# EAGLE design MRDT0003C1 (EAGLE 6.2)
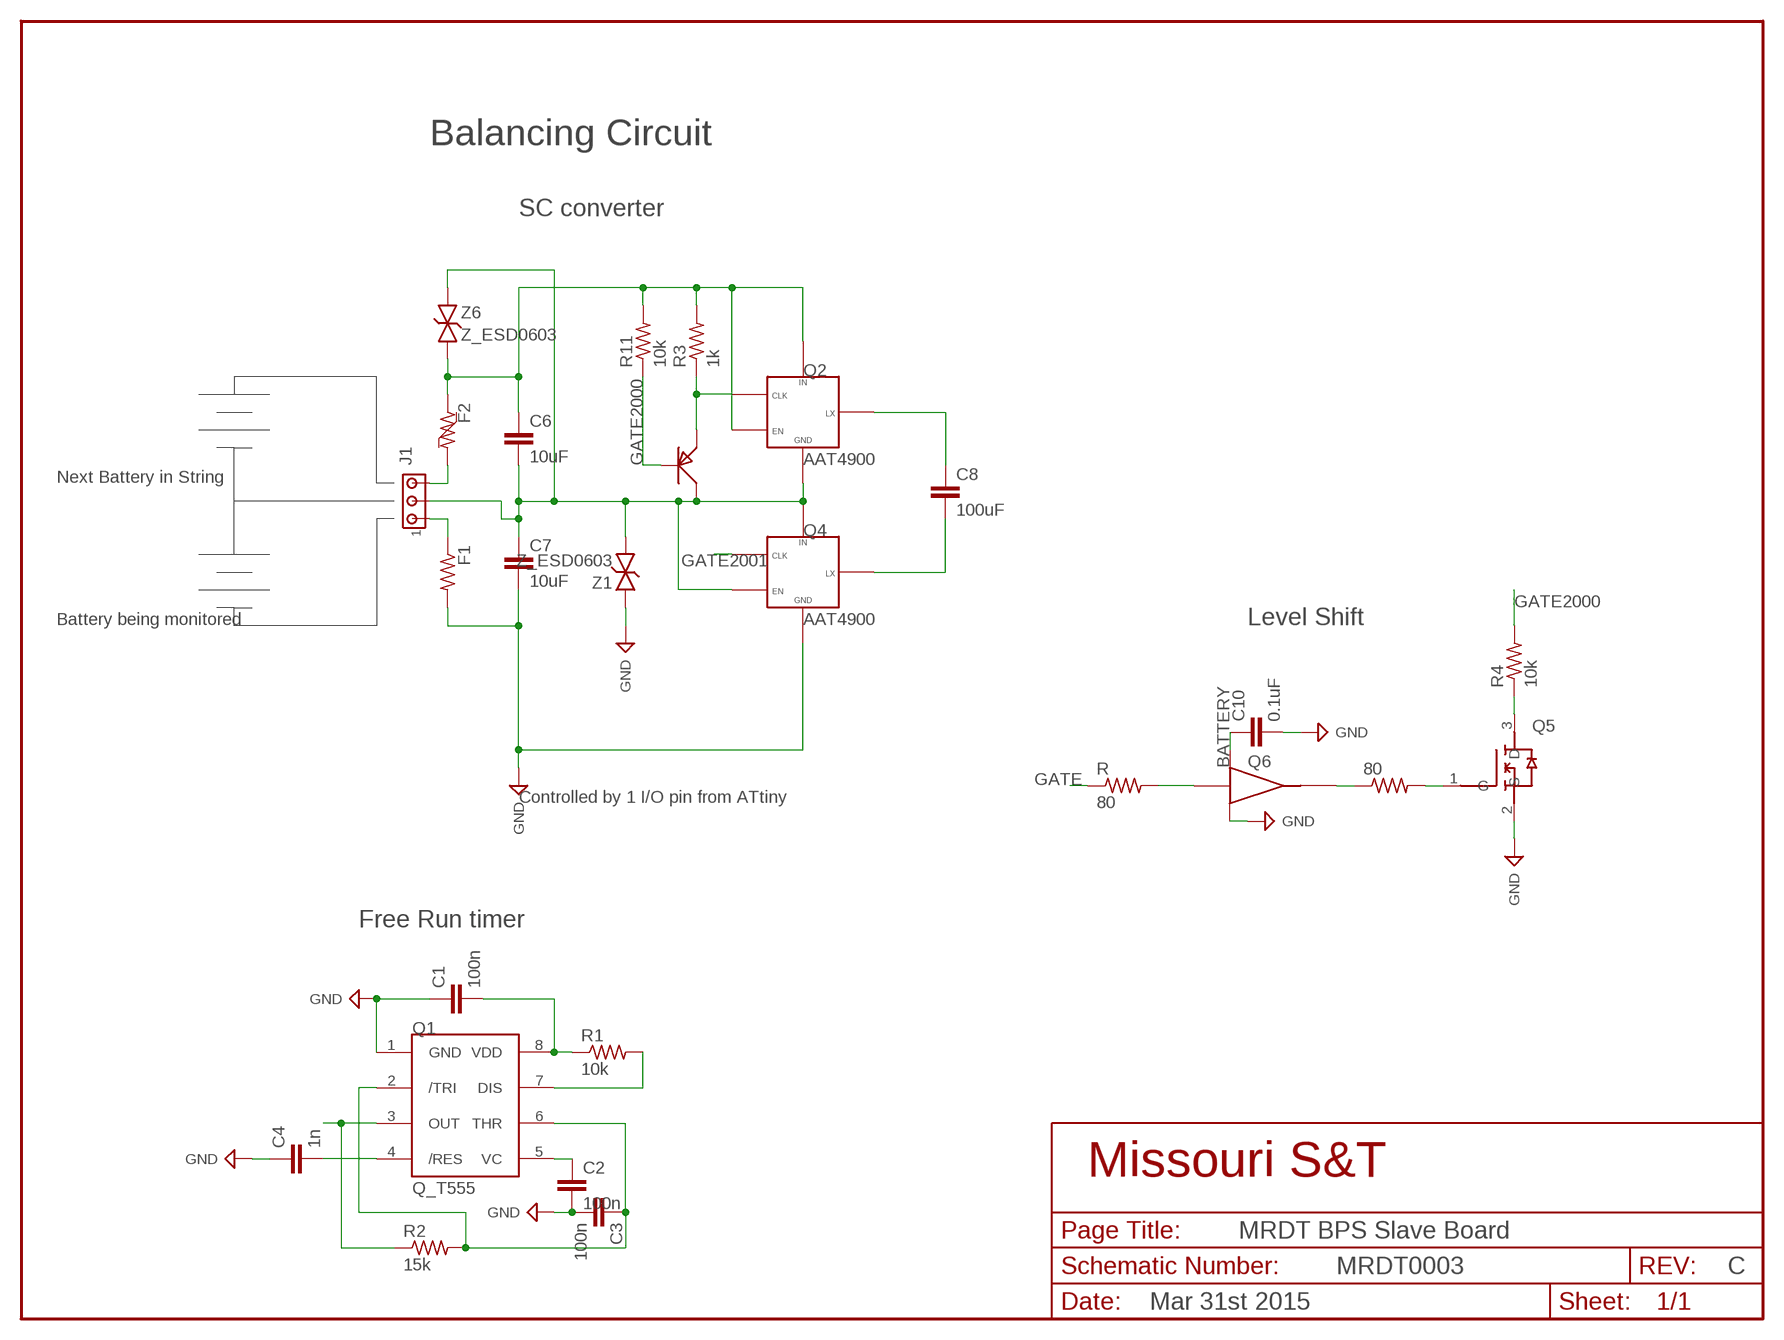
[diagram p0: schematic, sheet 1]

## Parts
80  R_RES_1206  [R_1206]
C1  100n  C_CAP_0603  [C_0603]
C2  100n  C_CAP_0603  [C_0603]
C3  100n  C_CAP_0603  [C_0603]
C4  1n  C_CAP_0603  [C_0603]
C6  10uF  C_CAP_1206  [C_1206]
C7  10uF  C_CAP_1206  [C_1206]
C8  100uF  C_CAP_1206  [C_1206]
C10  0.1uF  C_CAP_0603  [C_0603]
F1  R_RES_1210  [R_1210]
F2  R_RES_1210  [R_1210]
J1  J_HDR1X3_BRK_100MIL  [J_BRK1X3_100MIL]
Q1  Q_T555  [SOIC8]
Q2  AAT4900  Q_AAT4900  [SOT-23-5]
Q4  AAT4900  Q_AAT4900  [SOT-23-5]
Q5  N-CH-MOSFETSOT-23  [SOT-23]
Q6  Q_INVERTERSOT-23-5  [SOT-23-5]
Q7  Q_PNP  [SOT-23]
R  80  R_RES_0603  [R_0603]
R1  10k  R_RES_0603  [R_0603]
R2  15k  R_RES_0603  [R_0603]
R3  1k  R_RES_0603  [R_0603]
R4  10k  R_RES_0603  [R_0603]
R11  10k  R_RES_0603  [R_0603]
Z1  Z_ESD0603  [0603]
Z6  Z_ESD0603  [0603]

## Nets
BATTERY: C1.2 C4.2 C6.2 C7.1 C10.1 J1.2 Q1.4(/RES) Q1.8(VDD) Q2.2(GND) Q4.3(EN) Q4.5(IN) Q6.5(VCC) Q7.3(C) R1.1 Z1.1 Z6.2
GATE: Q1.3(OUT) R2.1 R.1
GATE2000: Q7.1(B) R4.2 R11.1
GATE2001: Q4.4(CLK) Q6.2(A) R.2
GND: C1.1 C2.2 C3.2 C4.1 C7.2 C10.2 F1.2 Q1.1(GND) Q4.2(GND) Q5.2(S) Q6.3(GND) Z1.2 ; supply symbol labelled SUP_GND
N$2: Q2.4(CLK) Q7.2(E) R3.1
N$3: F2.2 J1.3
N$4: C8.1 Q2.1(LX)
N$5: C8.2 Q4.1(LX)
N$6: F1.1 J1.1
N$8: Q1.7(DIS) R1.2
N$9: Q5.3(D) R4.1
N$10: 80.1 Q6.4(Y)
N$11: 80.2 Q5.1(G)
N$12: C6.1 F2.1 Q2.3(EN) Q2.5(IN) R3.2 R11.2 Z6.1
N$13: C3.1 Q1.2(/TRI) Q1.6(THR) R2.2
N$14: C2.1 Q1.5(VC)

## Notes on the sheet
- Balancing Circuit
- SC converter
- Next Battery in String
- Battery being monitored | Level Shift
- Controlled by 1 I/O pin from ATtiny
- Free Run timer
- MRDT BPS Slave Board
- MRDT0003 | C
- Mar 31st 2015

## Library data of the parts
80 F1 F2 R R1-R4 R11 = Lib_Passive:R_RES
C1-C4 C6 C7 C10 = Lib_Passive:C_CAP
C8 = Master:C_CAP
J1 = Lib_Electromechanical:J_HDR1X3
Q1 = Master:Q_T555
Q2 Q4 = Master:Q_AAT4900
Q5 = Master:N-CH-MOSFET: Generic N-CH MOSFET
Q6 = Master:Q_INVERTER
Q7 = Master:Q_PNP
Z1 Z6 = Master:Z_ESD

## Board
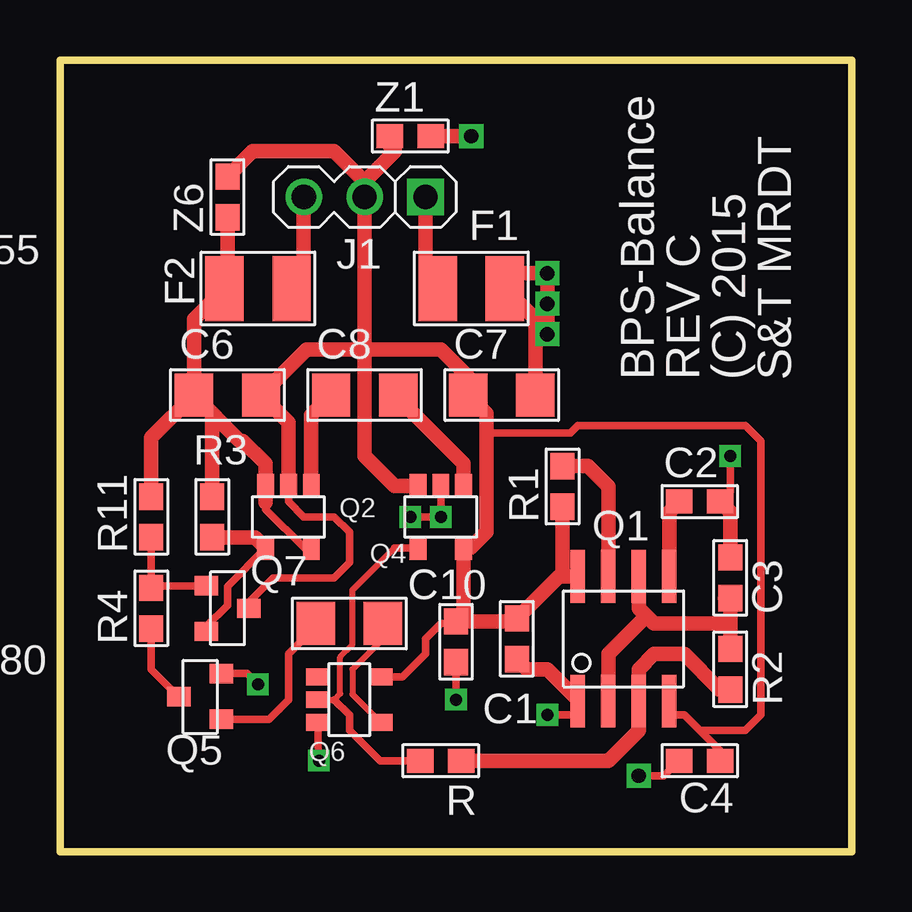
[diagram p1: board, top side]
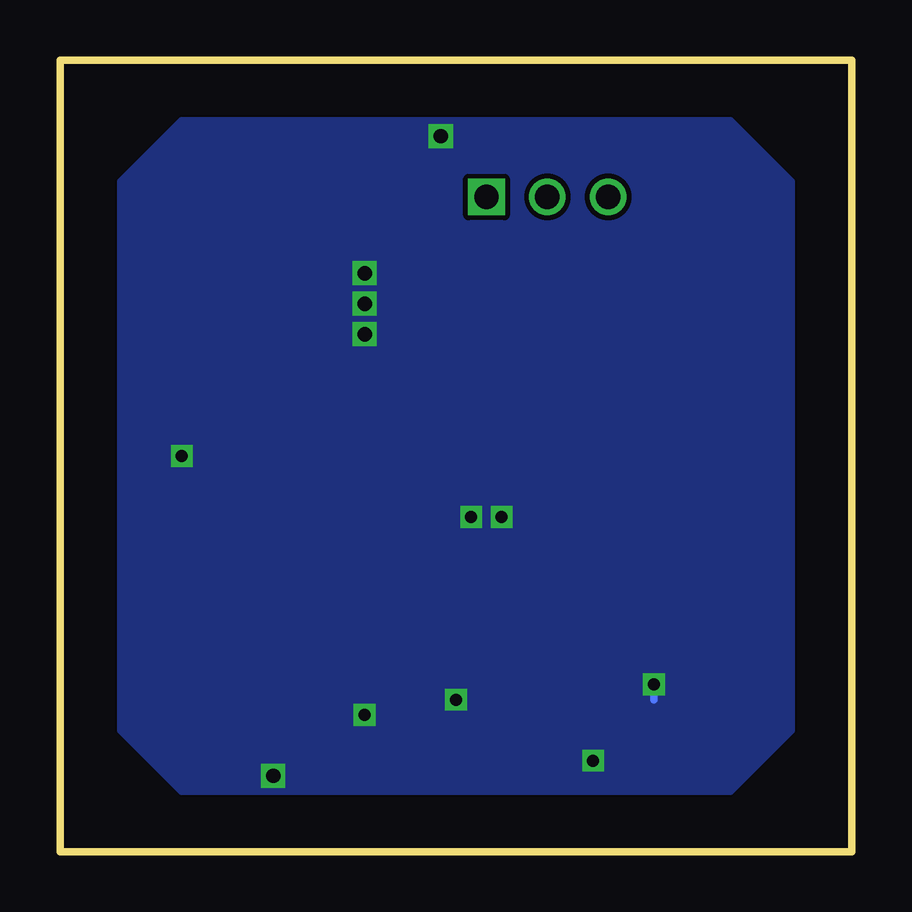
[diagram p2: board, bottom side, seen from below]

Size 33.02 x 33.02 mm. Coordinates in mm from the lower left corner, seen from the top.
Outline: 0,0 0,33.02 33.02,33.02 33.02,0 0,0
Copper layers (1*16): Top 0.035mm / dielectric 1.5mm / Bottom 0.035mm
Design rules: minimum track width 10mil, minimum drill 24mil, track to track 8mil, track to pad 8mil, pad to pad 8mil, via to via 8mil, smd to smd 8mil, copper to edge 40mil, drill to drill 8mil, minimum pad ring 10mil, minimum via ring 8mil, stop-mask expansion 4mil, vias tented up to drill 0mil, thermal gap 10mil

### Footprints (pad centres in the part's own frame; a part is rotated, then mirrored left to right if it is on the bottom)
R_1206 = smd 1.6 x 1.8: 1 -1.4,0; 2 1.4,0
C_0603 = smd 1.1 x 1: 1 -0.85,0; 2 0.85,0
C_1206 = smd 1.6 x 1.8: 1 -1.4,0; 2 1.4,0
R_1210 = smd 1.6 x 2.7: 1 -1.4,0; 2 1.4,0
J_BRK1X3_100MIL = drill 1.016 square: 1 2.54,0 | drill 1.016: 2 0,0; 3 -2.54,0
SOIC8 = smd 2.2 x 0.6: 1 -2.6,1.905; 2 -2.6,0.635; 3 -2.6,-0.635; 4 -2.6,-1.905; 5 2.6,-1.905; 6 2.6,-0.635; 7 2.6,0.635; 8 2.6,1.905
SOT-23-5 = smd 0.7 x 1: 1 -0.95,-1.3; 2 0,-1.3; 3 0.95,-1.3; 4 0.95,1.3; 5 -0.95,1.3
SOT-23 = smd 0.802 x 0.972: 1 -0.94,-0.885; 2 0.96,-0.885; 3 0,0.885
R_0603 = smd 1.1 x 1: 1 -0.85,0; 2 0.85,0
0603 = smd 1.1 x 1: 1 -0.85,0; 2 0.85,0

### Placement (x,y rotation side)
80  12.06,9.53 180 top
C1  19.05,8.89 90 top
C2  26.67,14.61 0 top
C3  27.94,11.43 90 top
C4  26.67,3.81 0 top
C6  6.99,19.05 0 top
C7  18.41,19.05 0 top
C8  12.7,19.05 0 top
C10  16.51,8.76 270 top
F1  17.14,23.5 0 top
F2  8.26,23.5 0 top
J1  12.7,27.3 0 top
Q1  23.5,8.89 90 top
Q2  9.53,13.97 180 top
Q4  15.88,13.97 180 top
Q5  5.84,6.48 90 top
Q6  12.06,6.35 270 top
Q7  6.99,10.16 270 top
R  15.88,3.81 180 top
R1  20.95,15.24 90 top
R2  27.94,7.62 90 top
R3  6.35,13.97 90 top
R4  3.81,10.16 90 top
R11  3.81,13.97 90 top
Z1  14.61,29.84 0 top
Z6  6.99,27.3 90 top

### Tracks (layer width: path | path; a pad name or v marks a point on that pad's centre or on a via)
BATTERY
  Top 0.305: Q2.2 9.53,14.61 10.16,13.97 11.43,13.97 12.06,13.34 12.06,12.06 11.43,11.43 8.89,11.43 7.87,10.41 Q7.3 | Q6.5 14.29,7.3 15.24,8.26 15.24,8.89 15.88,9.53 16.42,9.53 C10.1 | Q1.4 25.4,5.71 26.04,5.71 26.67,5.08 | 26.67,5.08 28.57,5.08 29.21,5.71 29.21,17.14 28.57,17.78 21.59,17.78 21.27,17.46 17.78,17.46 | C4.2 27.52,4.23 26.67,5.08
  Top 0.61: Q2.2 9.53,17.91 C6.2 10.29,20.95 12.7,20.95 | 12.7,20.95 15.88,20.95 17.02,19.82 C7.1 17.78,18.29 17.78,17.46 17.78,13.34 17.11,12.67 Q4.5 16.82,9.93 17.14,9.61 | 12.7,20.95 J1.2 12.7,27.94 | Q4.3 13.94,15.27 12.7,16.51 12.7,20.95 | Q1.8 20.95,11.49 | 20.95,11.49 20.8,11.49 C1.2 18.92,9.61 17.14,9.61 | R1.1 20.95,11.49 | C10.1 17.14,9.61 | 12.7,27.94 11.43,29.21 8.04,29.21 Z6.2 | 12.7,27.94 13.97,29.21 13.76,29.43 Z1.1
GATE
  Top 0.61: R2.1 27.52,6.77 26.04,8.26 24.77,8.26 24.13,7.62 Q1.3 24.13,5.08 22.86,3.81 R.1
GATE2000
  Top 0.305: R11.1 R4.2 3.9,11.1 Q7.1
GATE2001
  Top 0.254: Q6.2 11.43,6.35 11.68,6.6 11.68,8.13 12.19,8.64 12.19,10.92 13.94,12.67
  Top 0.305: Q4.4 13.94,12.67 | R.2 13.34,3.81 12.06,5.08 12.06,5.71 11.43,6.35
GND  (via drill 0.5, 0.6)
  Top 0.305: 18.92,7.91 C1.1 | Q5.2 7.8,7.44 v8.26,6.99 | Q4.2 v15.88,13.97 v14.61,13.97 | v16.51,6.35 C10.2 | v20.32,5.71 21.59,5.71 21.59,6.35 | Q6.3 10.77,4.47 v10.79,3.81 | v27.94,16.51 27.94,15.03 C2.2 | v24.13,3.17 25.18,3.17 C4.1
  Top 0.61: Q1.1 21.59,6.35 20.32,7.62 19.47,7.62 C1.1 | C3.2 27.94,14.19 C2.2 | C7.2 19.82,22.23 F1.2 19.18,24.13 v20.32,24.13 v20.32,21.59 | Z1.2 v17.14,29.84
  Bottom 0.305: v8.26,6.99 8.26,6.35
  other vias: 20.32,22.86
  pour Bottom: 2.54,27.94 5.08,30.48 27.94,30.48 30.48,27.94 30.48,5.08 27.94,2.54 5.08,2.54 2.54,5.08
N$2
  Top 0.305: Q7.2 6.1,9.4 6.99,10.29 6.99,11.08 Q2.4
  Top 0.61: R3.1 8.12,13.12 Q2.4
N$3
  Top 0.61: J1.3 10.16,24 F2.2
N$4
  Top 0.61: Q2.1 10.47,18.23 C8.1
N$5
  Top 0.61: C8.2 14.1,18.92 16.82,16.2 Q4.1
N$6
  Top 0.61: J1.1 15.24,24 F1.1
N$8
  Top 0.61: Q1.7 22.86,15.24 22.01,16.09 R1.2
N$9
  Top 0.305: R4.1 3.81,7.62 Q5.3
N$10
  Top 0.254: 80.1 13.46,8.89 12.19,7.62 12.19,6.57 Q6.4
N$11
  Top 0.305: Q5.1 8.71,5.54 9.53,6.35 9.53,8.26 10.16,8.89 10.16,9.02 80.2
N$12
  Top 0.305: Q2.5 10.19,12.67 8.57,14.29 8.57,14.57 | 6.35,24 F2.1
  Top 0.61: C6.1 7.49,17.14 7.62,17.14 8.57,16.19 Q2.3 8.57,14.57 | C6.1 5.58,22.23 F2.1 6.99,23.62 Z6.1 | R3.2 6.35,18.29 C6.1 | R11.2 3.81,17.27 C6.1
N$13
  Top 0.61: 27.73,10.58 C3.1 27.94,9.53 | 27.94,9.53 24.77,9.53 24.45,9.84 | 24.45,9.84 24.13,10.16 Q1.6 | R2.2 27.94,9.53 | Q1.2 22.86,8.26 24.45,9.84
N$14
  Top 0.61: Q1.5 25.4,14.19 C2.1

### Text on the board
tPlace: BPS-Balance | REV C | (C) 2015 | S&T MRDT